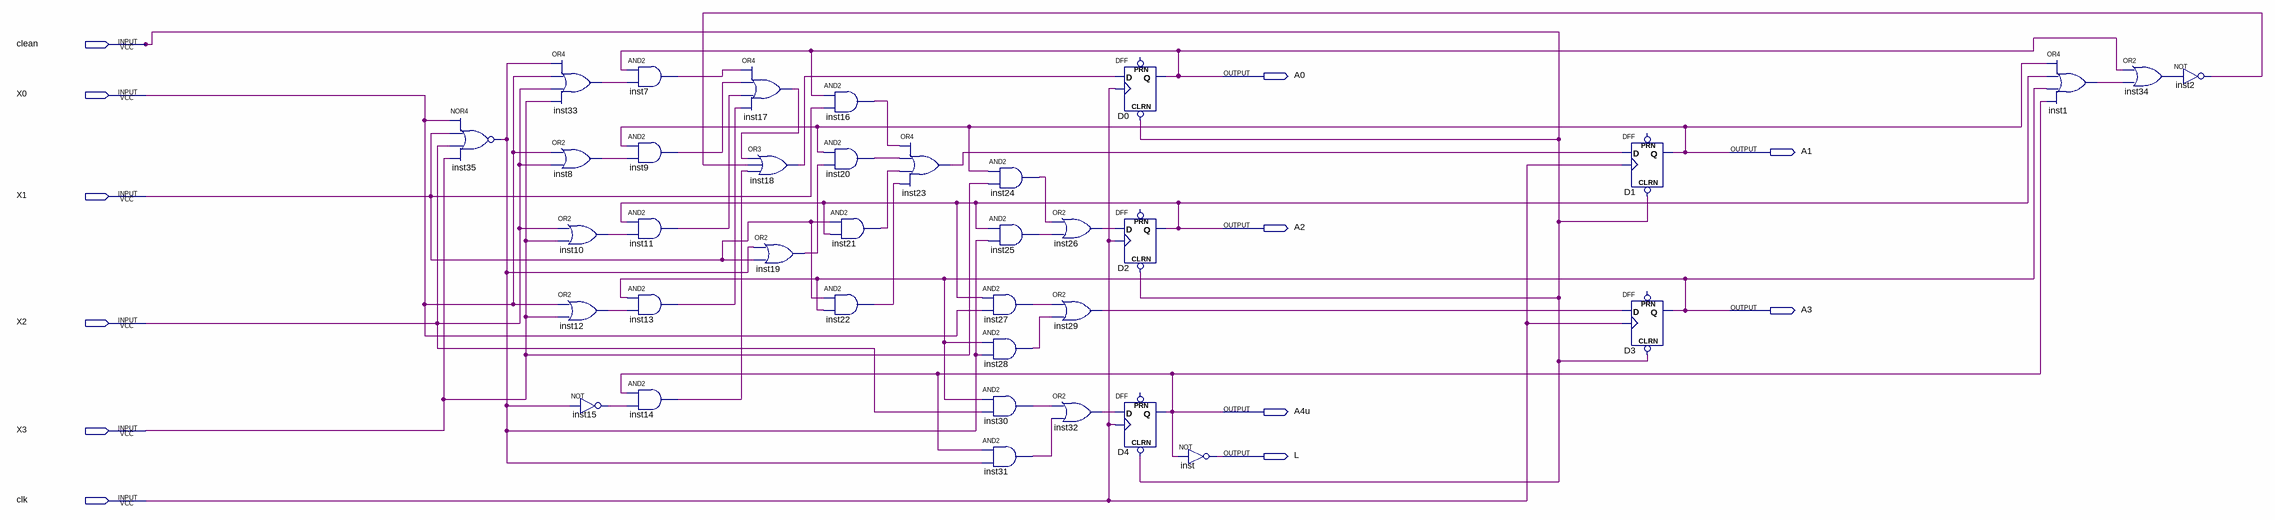
[diagram p0: schematic sheet]
// Quartus schematic B0729056_LAB02.bdf as structural Verilog: 37 symbols, 12 pins
module B0729056_LAB02 (
  input  clean,
  input  X0,
  input  X1,
  input  X2,
  input  X3,
  input  clk,
  output A0,
  output A1,
  output A2,
  output A3,
  output A4u,
  output L
);

  wire inst1_out, inst2_out, inst7_out, inst8_out, inst9_out, inst10_out, inst11_out, inst12_out, inst13_out,
       inst14_out, inst15_out, inst16_out, inst17_out, inst18_out, inst19_out, inst20_out, inst21_out,
       inst22_out, inst23_out, inst24_out, inst25_out, inst26_out, inst27_out, inst28_out, inst29_out,
       inst30_out, inst31_out, inst32_out, inst33_out, inst34_out, inst35_out;

  nor inst35 (inst35_out, X0, X1, X2, X3);
  or inst33 (inst33_out, inst35_out, X0, X2, X3);
  or inst8 (inst8_out, X0, X2);
  or inst10 (inst10_out, X2, X3);
  or inst12 (inst12_out, X0, X3);
  not inst15 (inst15_out, inst35_out);
  and inst7 (inst7_out, A0, inst33_out);
  and inst9 (inst9_out, A1, inst8_out);
  and inst11 (inst11_out, A2, inst10_out);
  and inst13 (inst13_out, A3, inst12_out);
  and inst14 (inst14_out, A4u, inst15_out);
  or inst17 (inst17_out, inst7_out, inst9_out, inst11_out, inst13_out);
  or inst18 (inst18_out, inst17_out, inst2_out, inst14_out);
  or inst19 (inst19_out, inst35_out, X1);
  and inst16 (inst16_out, A0, X1);
  and inst20 (inst20_out, A1, inst19_out);
  and inst21 (inst21_out, X1, A2);
  and inst22 (inst22_out, X1, A3);
  or inst23 (inst23_out, inst16_out, inst20_out, inst21_out, inst22_out);
  and inst24 (inst24_out, A1, X3);
  and inst25 (inst25_out, A2, inst35_out);
  and inst27 (inst27_out, A2, X0);
  and inst28 (inst28_out, A3, inst35_out);
  and inst30 (inst30_out, A3, X2);
  and inst31 (inst31_out, A4u, inst35_out);
  or inst26 (inst26_out, inst24_out, inst25_out);
  or inst29 (inst29_out, inst27_out, inst28_out);
  or inst32 (inst32_out, inst30_out, inst31_out);
  DFF D0 (.CLRN(clean), .CLK(clk), .D(inst18_out), .Q(A0));  // open: PRN
  DFF D2 (.CLRN(clean), .CLK(clk), .D(inst26_out), .Q(A2));  // open: PRN
  DFF D4 (.CLRN(clean), .CLK(clk), .D(inst32_out), .Q(A4u));  // open: PRN
  not inst (L, A4u);
  DFF D1 (.CLRN(clean), .CLK(clk), .D(inst23_out), .Q(A1));  // open: PRN
  DFF D3 (.CLRN(clean), .CLK(clk), .D(inst29_out), .Q(A3));  // open: PRN
  or inst1 (inst1_out, A1, A2, A3, A4u);
  or inst34 (inst34_out, A0, inst1_out);
  not inst2 (inst2_out, inst34_out);
endmodule
